# Altium schematic sheet LevelShiftingXMOD.SchDoc
size A4; CompanyName: Technische Hochschule Nürnberg Georg Simon Ohm; Organization: UltraZohm; Address1: Kesslerplatz 12; Address2: 90489 Nürnberg; Address3: GERMANY; SheetNumber: 23; SheetTotal: 36; Website: www.ultrazohm.com
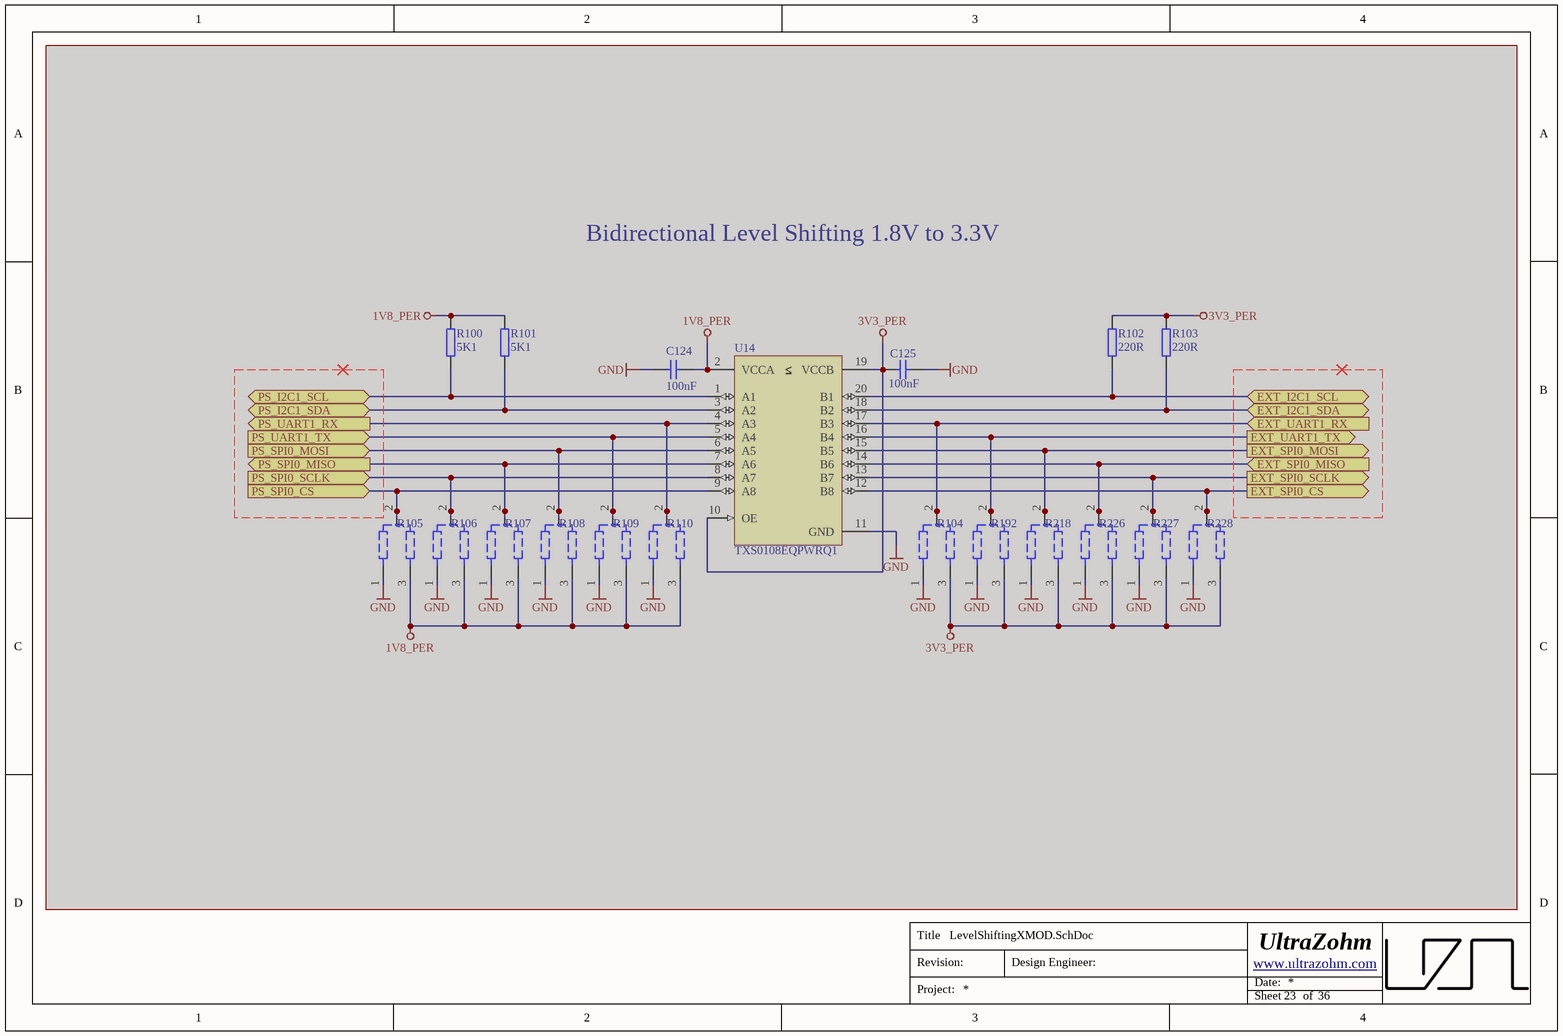
[diagram p0: LevelShiftingXMOD.SchDoc]

## Parts
C124  100nF  [CAPC1608X90N_V]  (masked out: inside a compile mask, not in the netlist)
C125  100nF  [CAPC1608X90N_V]  (masked out: inside a compile mask, not in the netlist)
R100  5K1  [RESC1608X55N_V]  (masked out: inside a compile mask, not in the netlist)
R101  5K1  [RESC1608X55N_V]  (masked out: inside a compile mask, not in the netlist)
R102  220R  [RESC1608X55N_V]  (masked out: inside a compile mask, not in the netlist)
R103  220R  [RESC1608X55N_V]  (masked out: inside a compile mask, not in the netlist)
R104  Manual Assembly 1608 (0603)  [TP_DUAL_RES_0603]  (value not drawn)  (no BOM)  (masked out: inside a compile mask, not in the netlist)
R105  Manual Assembly 1608 (0603)  [TP_DUAL_RES_0603]  (value not drawn)  (no BOM)  (masked out: inside a compile mask, not in the netlist)
R106  Manual Assembly 1608 (0603)  [TP_DUAL_RES_0603]  (value not drawn)  (no BOM)  (masked out: inside a compile mask, not in the netlist)
R107  Manual Assembly 1608 (0603)  [TP_DUAL_RES_0603]  (value not drawn)  (no BOM)  (masked out: inside a compile mask, not in the netlist)
R108  Manual Assembly 1608 (0603)  [TP_DUAL_RES_0603]  (value not drawn)  (no BOM)  (masked out: inside a compile mask, not in the netlist)
R109  Manual Assembly 1608 (0603)  [TP_DUAL_RES_0603]  (value not drawn)  (no BOM)  (masked out: inside a compile mask, not in the netlist)
R110  Manual Assembly 1608 (0603)  [TP_DUAL_RES_0603]  (value not drawn)  (no BOM)  (masked out: inside a compile mask, not in the netlist)
R192  Manual Assembly 1608 (0603)  [TP_DUAL_RES_0603]  (value not drawn)  (no BOM)  (masked out: inside a compile mask, not in the netlist)
R218  Manual Assembly 1608 (0603)  [TP_DUAL_RES_0603]  (value not drawn)  (no BOM)  (masked out: inside a compile mask, not in the netlist)
R226  Manual Assembly 1608 (0603)  [TP_DUAL_RES_0603]  (value not drawn)  (no BOM)  (masked out: inside a compile mask, not in the netlist)
R227  Manual Assembly 1608 (0603)  [TP_DUAL_RES_0603]  (value not drawn)  (no BOM)  (masked out: inside a compile mask, not in the netlist)
R228  Manual Assembly 1608 (0603)  [TP_DUAL_RES_0603]  (value not drawn)  (no BOM)  (masked out: inside a compile mask, not in the netlist)
U14  TXS0108EQPWRQ1  [SOP65P640X120-20N]  (masked out: inside a compile mask, not in the netlist)

## Ports
EXT_I2C1_SCL (bidir), EXT_I2C1_SDA (bidir), EXT_SPI0_CS (out), EXT_SPI0_MISO (in), EXT_SPI0_MOSI (out), EXT_SPI0_SCLK (out), EXT_UART1_RX (in), EXT_UART1_TX (out), PS_I2C1_SCL (bidir), PS_I2C1_SDA (bidir), PS_SPI0_CS (in), PS_SPI0_MISO (out), PS_SPI0_MOSI (in), PS_SPI0_SCLK (in), PS_UART1_RX (out), PS_UART1_TX (in)

## Notes on the sheet
- Bidirectional Level Shifting 1.8V to 3.3V
- Title
- Revision:
- Design Engineer:
- Date:
- Project:
- Sheet
- of

## Library data of the parts
C124 C125 = 21382: KON 100nF 50V X7R ±10% SMD BF 1608 (0603); Value: 100n; AN: 21382; Mixed: SMT; Preferred: Yes; Temperature-Range: -55/+125; Tolerance: ±10%; Voltage: 50V; Technology: X7R; Case: 1608 (0603)
R100 R101 = 21379: WID SMD 5K1 1% 0,1W; Value: 5.1K; AN: 21379; Mixed: SMT; Preferred: Yes; Extra: BF 1608 (0603); Tolerance: 1%; Case: 1608 (0603); Technology: TK100
R102 R103 = 22324: WID SMD 220R 1% 0,1W; Value: 220; AN: 22324; Mixed: SMT; Extra: BF 1608 (0603); Tolerance: 1%; Case: 1608 (0603); Technology: TK100
R104-R110 R192 R218 R226-R228 = 30792: Manual Assembly Resistors Placeholder 1608 (0603) Dual; AN: 30792; Mixed: MECH
U14 = 30791: AN: 30791; Mixed: SMT; Temperature-Range: -40/+85; Extra: 8-Bit Bidirectional Voltage Translator for OD/Push-Pull; HelpURL: b:\AD\adlib\datasheet\TI\TXS0108E-Q1\; H-ART: TXS0108EQPWRQ1; Storage-Temperature: -65/+150(Abs); Case: TSSOP20